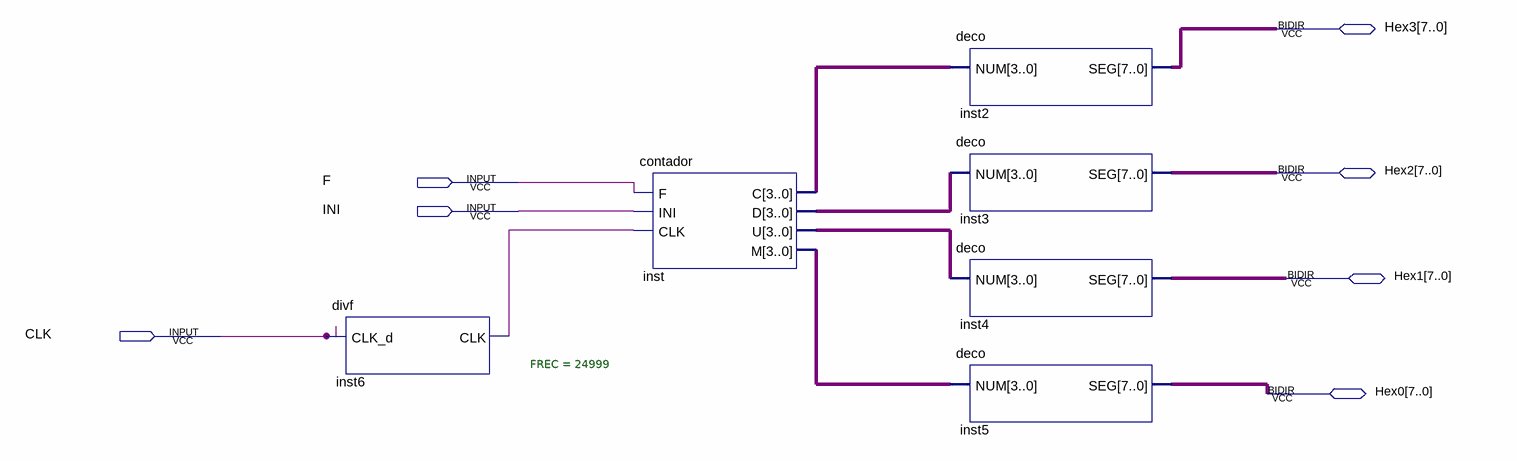
[diagram p0: schematic sheet]
// Quartus schematic PRACTICA1.bdf as structural Verilog: 6 symbols, 7 pins
module PRACTICA1 (
  input  F,
  input  INI,
  input  CLK,
  inout  [7:0] Hex3,
  inout  [7:0] Hex2,
  inout  [7:0] Hex1,
  inout  [7:0] Hex0
);

  wire inst6_clk;
  wire [3:0] inst_c, inst_d, inst_m, inst_u;

  divf #(.FREC(24999)) inst6 (.CLK_d(CLK), .CLK(inst6_clk));
  contador inst (.F(F), .INI(INI), .CLK(inst6_clk), .C(inst_c), .D(inst_d), .U(inst_u), .M(inst_m));
  deco inst2 (.NUM(inst_c), .SEG(Hex3));
  deco inst3 (.NUM(inst_d), .SEG(Hex2));
  deco inst4 (.NUM(inst_u), .SEG(Hex1));
  deco inst5 (.NUM(inst_m), .SEG(Hex0));
endmodule
